# EAGLE schematic relay-shield (EAGLE 6.4)
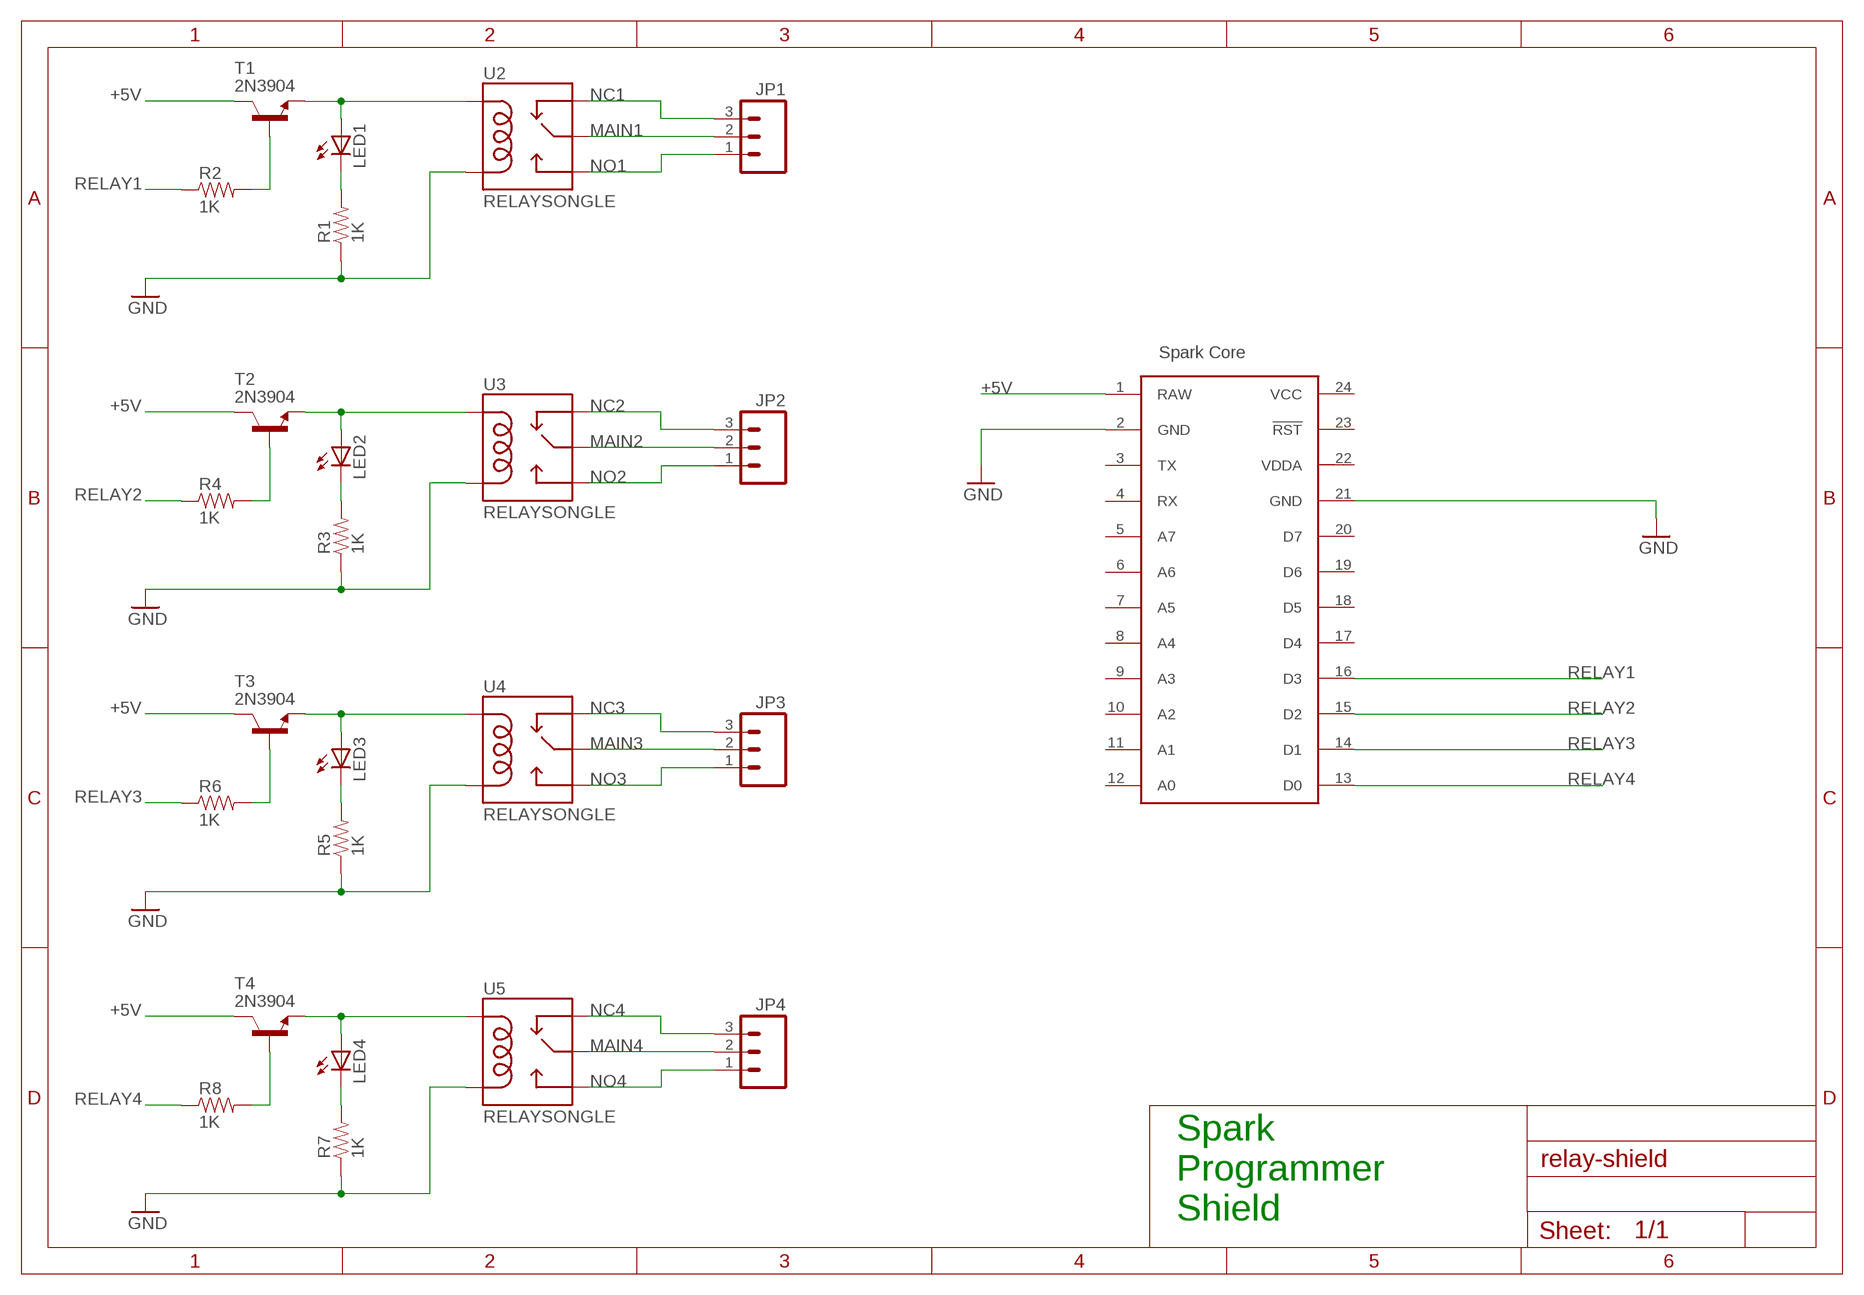
[diagram p0: schematic, sheet 1]

## Parts
JP1  M03-SCREW-5MM  [SCREWTERMINAL-5MM-3]
JP2  M03-SCREW-5MM  [SCREWTERMINAL-5MM-3]
JP3  M03-SCREW-5MM  [SCREWTERMINAL-5MM-3]
JP4  M03-SCREW-5MM  [SCREWTERMINAL-5MM-3]
LED1  LED3MM  [LED3MM]
LED2  LED3MM  [LED3MM]
LED3  LED3MM  [LED3MM]
LED4  LED3MM  [LED3MM]
R1  1K  RESISTORAXIAL-0.3  [AXIAL-0.3]
R2  1K  RESISTORAXIAL-0.3  [AXIAL-0.3]
R3  1K  RESISTORAXIAL-0.3  [AXIAL-0.3]
R4  1K  RESISTORAXIAL-0.3  [AXIAL-0.3]
R5  1K  RESISTORAXIAL-0.3  [AXIAL-0.3]
R6  1K  RESISTORAXIAL-0.3  [AXIAL-0.3]
R7  1K  RESISTORAXIAL-0.3  [AXIAL-0.3]
R8  1K  RESISTORAXIAL-0.3  [AXIAL-0.3]
T1  2N3904  [TO92]
T2  2N3904  [TO92]
T3  2N3904  [TO92]
T4  2N3904  [TO92]
U1  SPARK_CORECORE  [SPARK_CORE]
U2  RELAYSONGLE  [SRD-5VDC-SL-C]
U3  RELAYSONGLE  [SRD-5VDC-SL-C]
U4  RELAYSONGLE  [SRD-5VDC-SL-C]
U5  RELAYSONGLE  [SRD-5VDC-SL-C]

## Nets
+5V: T1.1(C) T2.1(C) T3.1(C) T4.1(C) U1.1(RAW)
GND: R1.P$1 R3.P$1 R5.P$1 R7.P$1 U1.2(GND) U1.21(GND) U2.COIL2 U3.COIL2 U4.COIL2 U5.COIL2
MAIN1: JP1.2 U2.COMMON(MAIN)
MAIN2: JP2.2 U3.COMMON(MAIN)
MAIN3: JP3.2 U4.COMMON(MAIN)
MAIN4: JP4.2 U5.COMMON(MAIN)
N$1: LED1.A T1.3(E) U2.COIL1
N$2: LED2.A T2.3(E) U3.COIL1
N$3: R2.P$2 T1.2(B)
N$4: LED1.K(C) R1.P$2
N$5: R4.P$2 T2.2(B)
N$6: LED2.K(C) R3.P$2
N$7: LED3.A T3.3(E) U4.COIL1
N$8: R6.P$2 T3.2(B)
N$9: LED3.K(C) R5.P$2
N$10: LED4.A T4.3(E) U5.COIL1
N$11: R8.P$2 T4.2(B)
N$12: LED4.K(C) R7.P$2
NC1: JP1.3 U2.CLOSED(NC)
NC2: JP2.3 U3.CLOSED(NC)
NC3: JP3.3 U4.CLOSED(NC)
NC4: JP4.3 U5.CLOSED(NC)
NO1: JP1.1 U2.OPEN(NO)
NO2: JP2.1 U3.OPEN(NO)
NO3: JP3.1 U4.OPEN(NO)
NO4: JP4.1 U5.OPEN(NO)
RELAY1: R2.P$1 U1.16(D3)
RELAY2: R4.P$1 U1.15(D2)
RELAY3: R6.P$1 U1.14(D1)
RELAY4: R8.P$1 U1.13(D0)
Unconnected: U1.3(TX) U1.4(RX) U1.5(A7) U1.6(A6) U1.7(A5) U1.8(A4) U1.9(A3) U1.10(A2) U1.11(A1) U1.12(A0) U1.17(D4) U1.18(D5) U1.19(D6) U1.20(D7) U1.23(!RST)

## Notes on the sheet
- Spark Core
- Spark
  Programmer
  Shield

## Power pins joined to a net without a drawn wire
VCC: U1.24(VCC)
VDDA: U1.22(VDDA)

## Library data of the parts
JP1-JP4 = SparkFun-Connectors:M03: Header 3 Standard 3-pin 0.1" header. Use with straight break away headers (SKU : PRT-00116), right angle break away headers (PRT-00553), swiss pins (PRT-00743), machine pins (PRT-00117), and female headers (PRT-00115). Molex polarized connector foot print use with SKU : PRT-08232 with associated crimp pins and housings.
LED1-LED4 = SparkFun-LED:LED: LEDs Standard schematic elements and footprints for 5mm, 3mm, 1206, and 0603 sized LEDs. 5mm - Spark Fun Electronics SKU : COM-00529 (and others)
R1-R8 = SparkFun-Passives:RESISTOR: Resistor Basic schematic elements and footprints for 0603, 1206, and PTH resistors.
T1-T4 = transistor:2N3904: NPN TRANSISTOR
U1 = Spark:SPARK_CORE
U2-U5 = Spark:RELAY: SPDT relay (COM-00101)